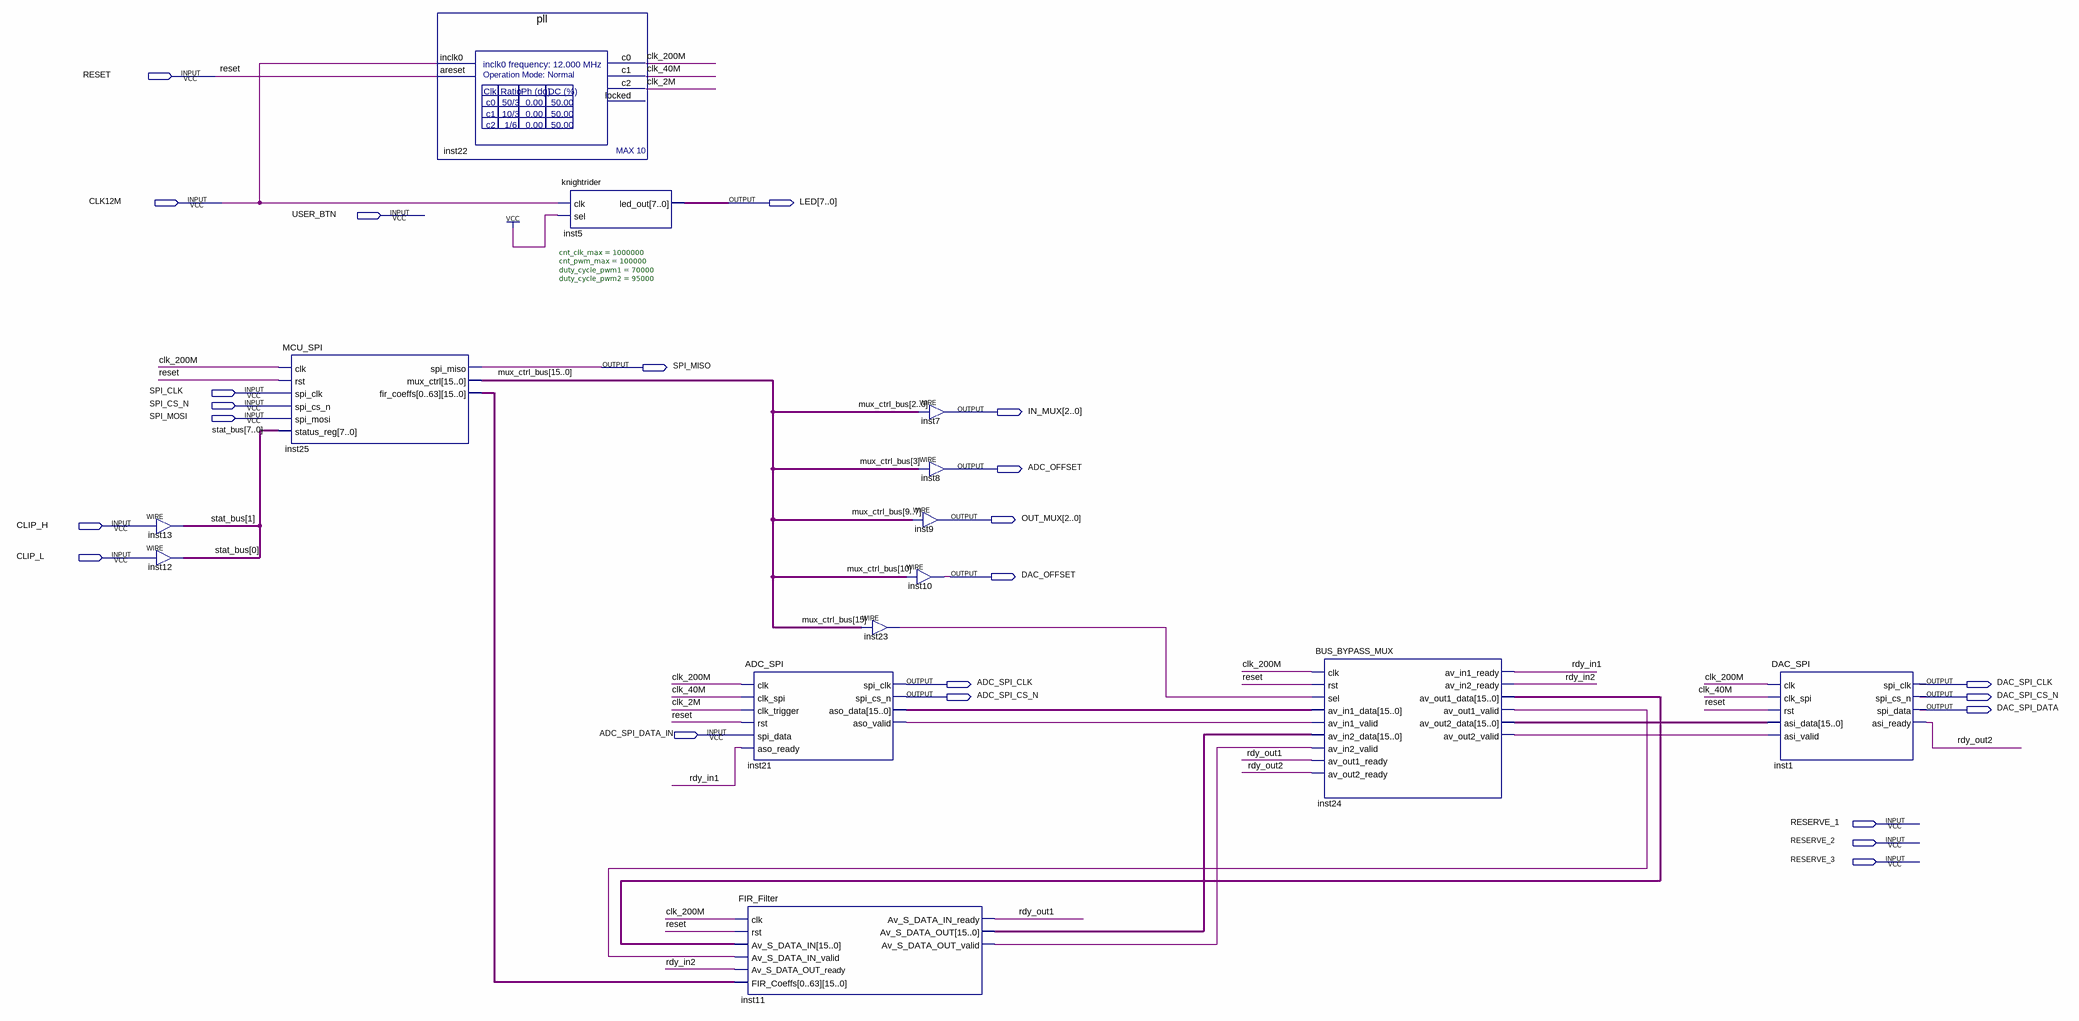
[diagram p0: schematic sheet]
// Quartus schematic test_board.bdf as structural Verilog: 14 symbols, 23 pins
module test_board (
  input  RESET,
  input  CLK12M,
  input  USER_BTN,
  input  SPI_CLK,
  input  SPI_CS_N,
  input  SPI_MOSI,
  input  CLIP_H,
  input  CLIP_L,
  input  ADC_SPI_DATA_IN,
  input  RESERVE_1,
  input  RESERVE_2,
  input  RESERVE_3,
  output [7:0] LED,
  output SPI_MISO,
  output [2:0] IN_MUX,
  output ADC_OFFSET,
  output [2:0] OUT_MUX,
  output DAC_OFFSET,
  output ADC_SPI_CLK,
  output DAC_SPI_CLK,
  output ADC_SPI_CS_N,
  output DAC_SPI_CS_N,
  output DAC_SPI_DATA
);

  wire clk_2M, clk_40M, clk_200M, inst11_av_s_data_out_valid, inst21_aso_valid, inst23_out,
       inst24_av_out1_valid, inst24_av_out2_valid, rdy_in1, rdy_in2, rdy_out1, rdy_out2;
  wire [7:0] stat_bus;
  wire [15:0] inst11_av_s_data_out, inst21_aso_data, inst24_av_out1_data, inst24_av_out2_data, mux_ctrl_bus;
  wire [1023:0] inst25_fir_coeffs;

  assign stat_bus[1] = CLIP_H;  // WIRE inst13
  assign stat_bus[0] = CLIP_L;  // WIRE inst12
  MCU_SPI inst25 (
    .clk(clk_200M), .rst(RESET), .spi_clk(SPI_CLK), .spi_cs_n(SPI_CS_N), .spi_mosi(SPI_MOSI),
    .status_reg(stat_bus), .spi_miso(SPI_MISO), .mux_ctrl(mux_ctrl_bus), .fir_coeffs(inst25_fir_coeffs));
  pll inst22 (.inclk0(CLK12M), .areset(RESET), .c0(clk_200M), .c1(clk_40M), .c2(clk_2M));  // open: locked
  knightrider #(.cnt_clk_max(1000000), .cnt_pwm_max(100000), .duty_cycle_pwm1(70000), .duty_cycle_pwm2(95000)) inst5 (
    .clk(CLK12M), .sel(1'b1), .led_out(LED));
  ADC_SPI inst21 (
    .clk(clk_200M), .clk_spi(clk_40M), .clk_trigger(clk_2M), .rst(RESET), .spi_data(ADC_SPI_DATA_IN),
    .aso_ready(rdy_in1), .spi_clk(ADC_SPI_CLK), .spi_cs_n(ADC_SPI_CS_N), .aso_data(inst21_aso_data),
    .aso_valid(inst21_aso_valid));
  FIR_Filter inst11 (
    .clk(clk_200M), .rst(RESET), .Av_S_DATA_IN(inst24_av_out1_data),
    .Av_S_DATA_IN_valid(inst24_av_out1_valid), .Av_S_DATA_OUT_ready(rdy_in2), .FIR_Coeffs(inst25_fir_coeffs),
    .Av_S_DATA_IN_ready(rdy_out1), .Av_S_DATA_OUT(inst11_av_s_data_out),
    .Av_S_DATA_OUT_valid(inst11_av_s_data_out_valid));
  assign inst23_out = mux_ctrl_bus[15];  // WIRE inst23
  assign IN_MUX = mux_ctrl_bus[2:0];  // WIRE inst7
  assign ADC_OFFSET = mux_ctrl_bus[3];  // WIRE inst8
  assign OUT_MUX = mux_ctrl_bus[9:7];  // WIRE inst9
  assign DAC_OFFSET = mux_ctrl_bus[10];  // WIRE inst10
  BUS_BYPASS_MUX inst24 (
    .clk(clk_200M), .rst(RESET), .sel(inst23_out), .av_in1_data(inst21_aso_data),
    .av_in1_valid(inst21_aso_valid), .av_in2_data(inst11_av_s_data_out),
    .av_in2_valid(inst11_av_s_data_out_valid), .av_out1_ready(rdy_out1), .av_out2_ready(rdy_out2),
    .av_in1_ready(rdy_in1), .av_in2_ready(rdy_in2), .av_out1_data(inst24_av_out1_data),
    .av_out1_valid(inst24_av_out1_valid), .av_out2_data(inst24_av_out2_data),
    .av_out2_valid(inst24_av_out2_valid));
  DAC_SPI inst1 (
    .clk(clk_200M), .clk_spi(clk_40M), .rst(RESET), .asi_data(inst24_av_out2_data),
    .asi_valid(inst24_av_out2_valid), .spi_clk(DAC_SPI_CLK), .spi_cs_n(DAC_SPI_CS_N),
    .spi_data(DAC_SPI_DATA), .asi_ready(rdy_out2));
endmodule
